# EAGLE design node (EAGLE 7.4.0)
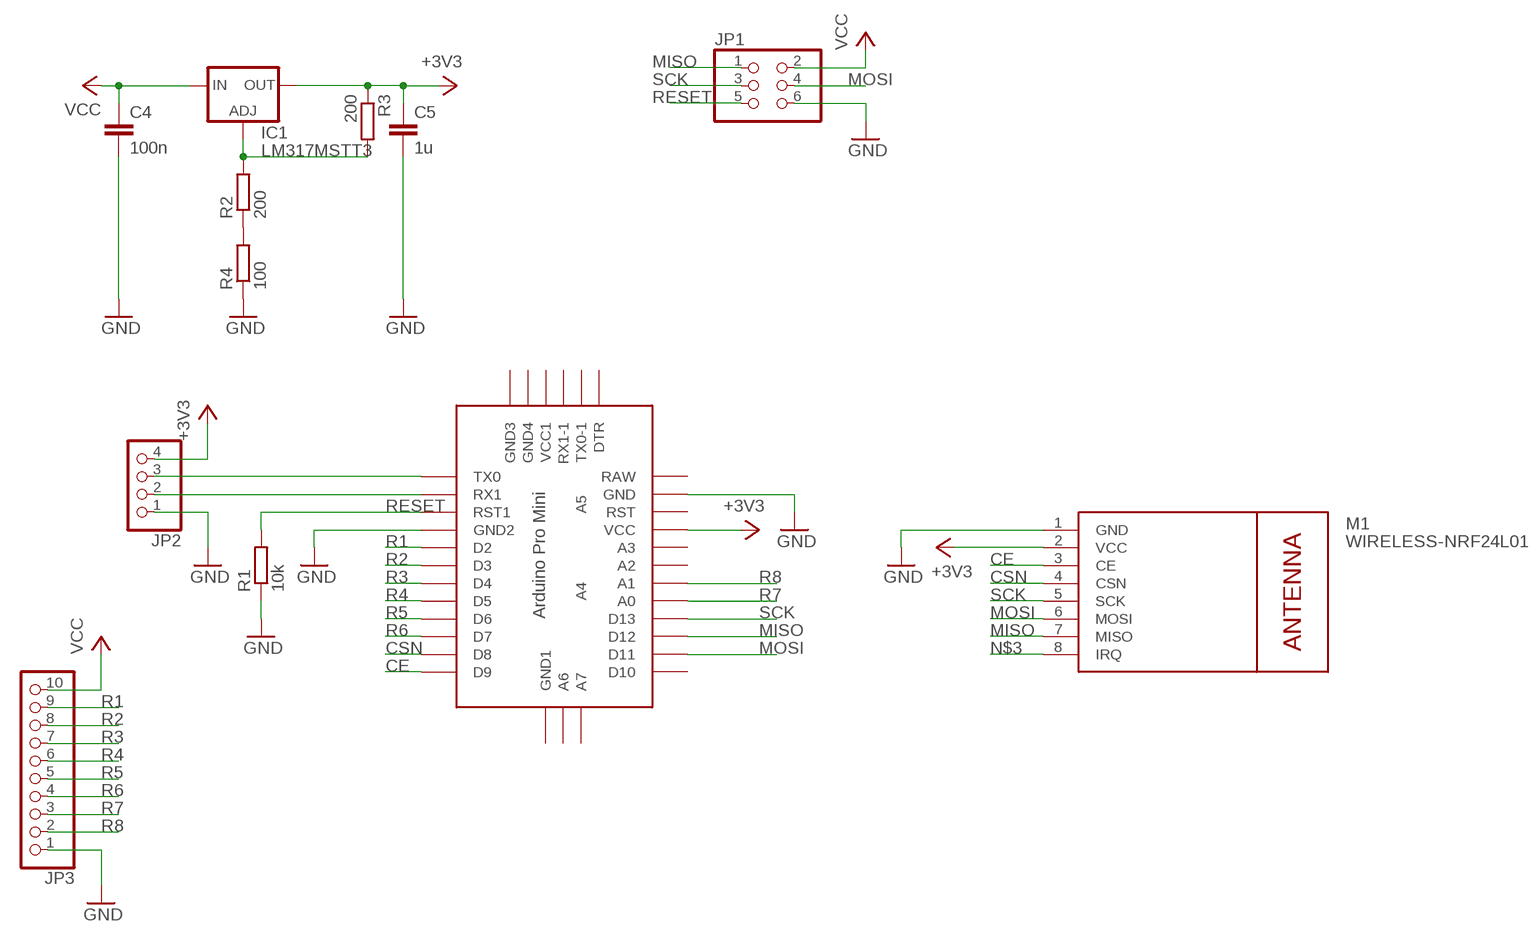
[diagram p0: schematic, sheet 1]

## Parts
C4  100n  C-EUC1206  [C1206]
C5  1u  C-EUC1206  [C1206]
IC1  LM317MSTT3  [SOT223]
JP1  PINHD-2X3  [2X03]
JP2  PINHD-1X4  [1X04]
JP3  PINHD-1X10  [1X10]
M1  WIRELESS-NRF24L01  [WIRELESS-NRF24L01]
R1  10k  R-EU_M1206  [M1206]
R2  200  R-EU_M1206  [M1206]
R3  200  R-EU_M1206  [M1206]
R4  100  R-EU_M1206  [M1206]
U$1  ABK-PRO-MINI  [ABK-PRO-MINI]

## Nets
+3V3: C5.1 IC1.4(OUT) JP2.4 M1.2(VCC) R3.1 U$1.VCC
ADJ_V3: IC1.1(ADJ) R2.2 R3.2
CE: M1.3(CE) U$1.D9
CSN: M1.4(CSN) U$1.D8
GND: C4.2 C5.2 JP1.6 JP2.1 JP3.1 M1.1(GND) R1.1 R4.1 U$1.GND U$1.GND1(GND2)
MISO: JP1.1 M1.7(MISO) U$1.D12
MOSI: JP1.4 M1.6(MOSI) U$1.D11
N$1: JP2.3 U$1.TX0
N$2: JP2.2 U$1.RX1
N$3: M1.8(IRQ)
N$5: R2.1 R4.2
R1: JP3.9 U$1.D2
R2: JP3.8 U$1.D3
R3: JP3.7 U$1.D4
R4: JP3.6 U$1.D5
R5: JP3.5 U$1.D6
R6: JP3.4 U$1.D7
R7: JP3.3 U$1.A0
R8: JP3.2 U$1.A1
RESET: JP1.5 R1.2 U$1.RST1
SCK: JP1.3 M1.5(SCK) U$1.D13
VCC: C4.1 IC1.3(IN) JP1.2 JP3.10
Unconnected: U$1.A2 U$1.A3 U$1.A4 U$1.A5 U$1.A6 U$1.A7 U$1.D10 U$1.DTR U$1.GND2(GND3) U$1.GND3(GND4) U$1.GND4(GND1) U$1.RAW U$1.RST U$1.RX1-1 U$1.TX0-1 U$1.VCC1

## Library data of the parts
C4 C5 = rcl:C-EU: CAPACITOR, European symbol
IC1 = v-reg:LM317?*: 500 mA Adjustable Output Positive Voltage Regulator Source: http://www.onsemi.co.jp .. LM317M-D.PDF
JP1 = pinhead:PINHD-2X3: PIN HEADER
JP2 = pinhead:PINHD-1X4: PIN HEADER
JP3 = pinhead:PINHD-1X10: PIN HEADER
M1 = diy-modules:WIRELESS-NRF24L01: 2.4 GHz Wireless Module based on NRF24L01 chip
R1-R4 = rcl:R-EU_: RESISTOR, European symbol
U$1 = Arduino-clone:ABK-PRO-MINI: ABK Pro-Mini Arduino Clone

## Net classes
0 default: clearance 0.205 mm

## Board
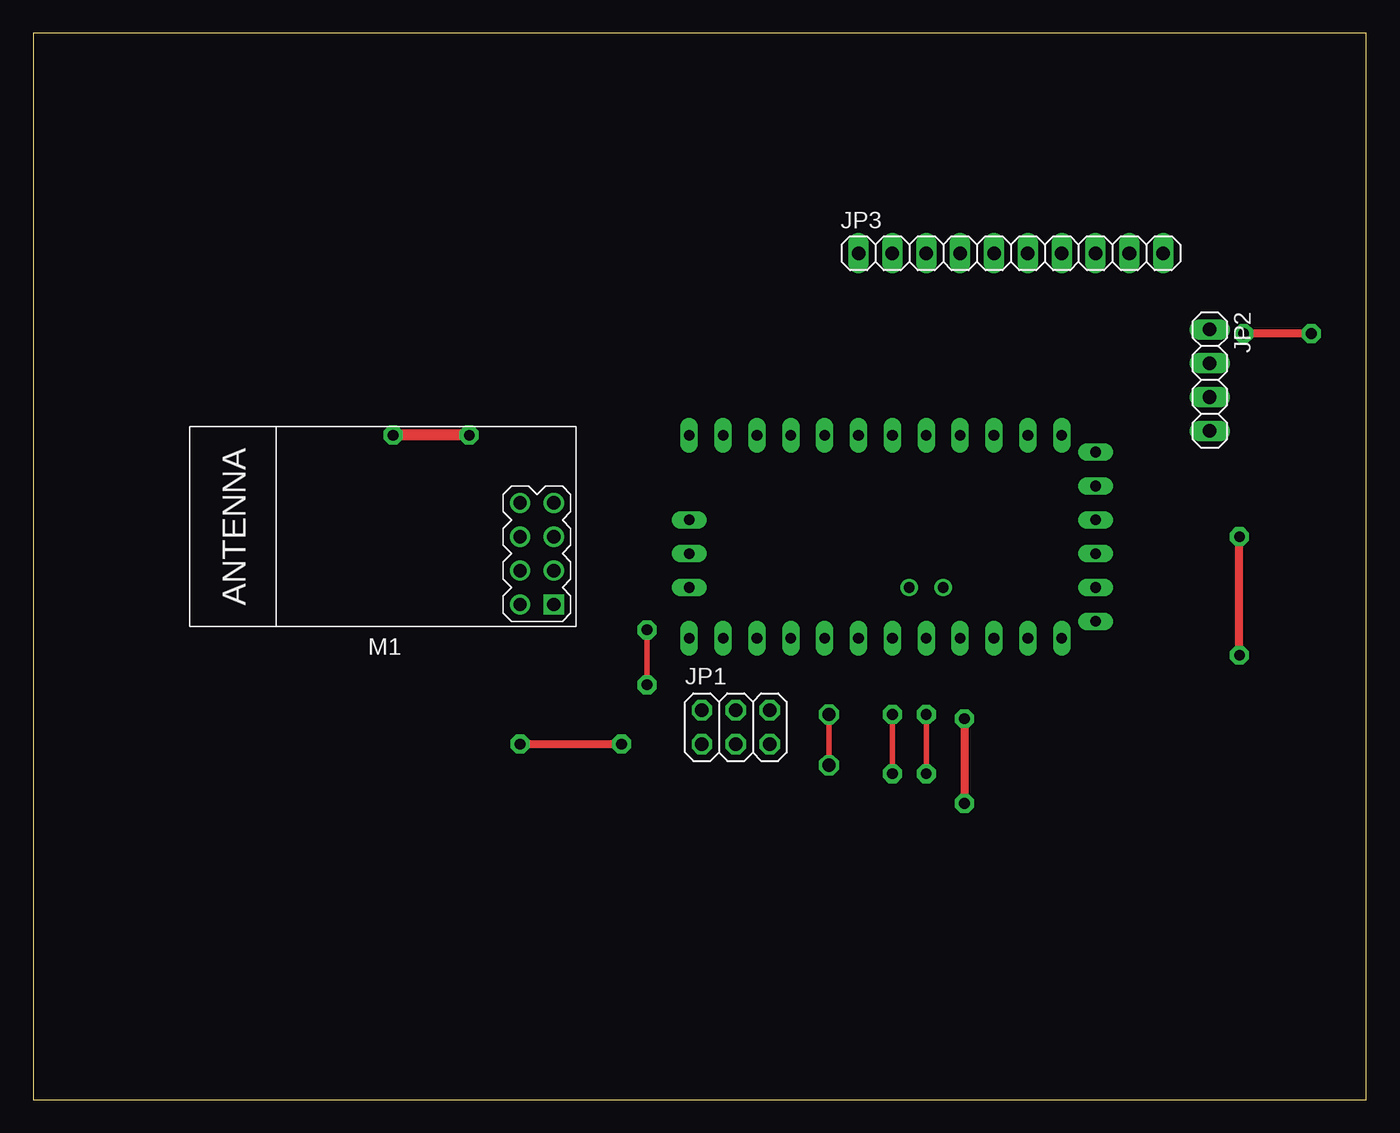
[diagram p1: board, top side]
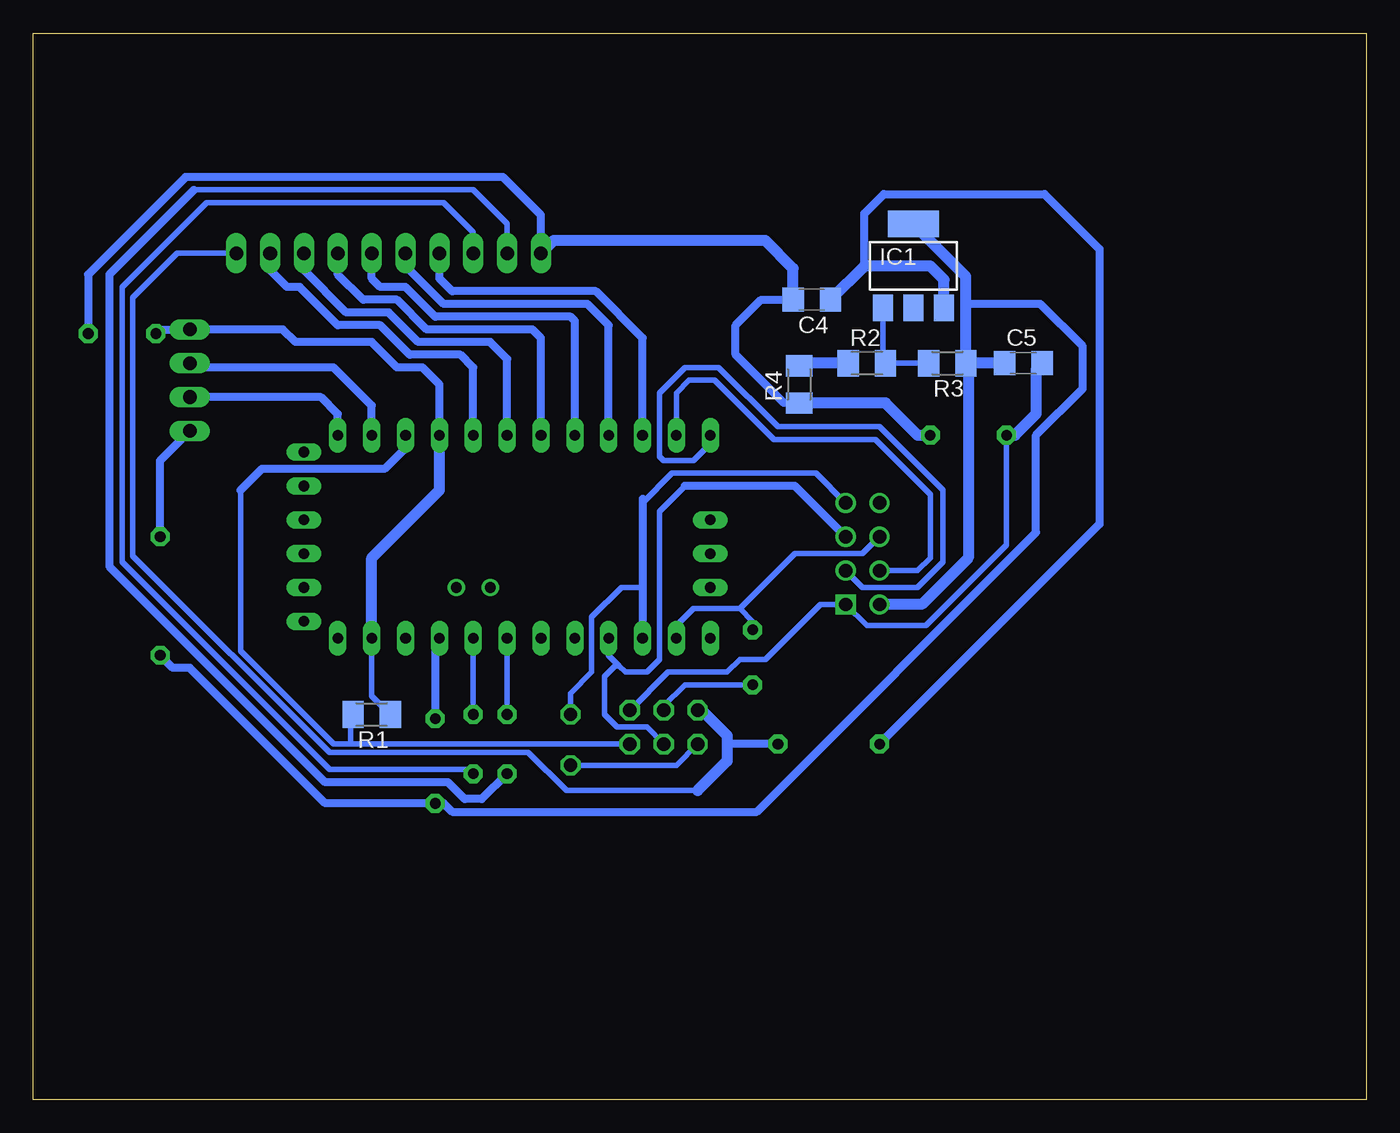
[diagram p2: board, bottom side, seen from below]

Size 100 x 80 mm. Coordinates in mm from the lower left corner, seen from the top.
Outline: 0,0 100,0 100,80 0,80 0,0
Copper layers (1*16): Top 0.035mm / dielectric 1.5mm / Bottom 0.035mm
Design rules "default": minimum track width 10mil, minimum drill 24mil, track to track 8mil, track to pad 8mil, pad to pad 8mil, via to via 8mil, smd to smd 8mil, copper to edge 40mil, drill to drill 8mil, minimum pad ring 10mil, minimum via ring 8mil, stop-mask expansion 4mil, vias tented up to drill 0mil, thermal gap 10mil

### Footprints (pad centres in the part's own frame; a part is rotated, then mirrored left to right if it is on the bottom)
C1206 = smd 1.6 x 1.8: 1 -1.4,0; 2 1.4,0
SOT223 = smd 1.5 x 2: 1 -2.3,-3.15; 2 0,-3.15; 3 2.3,-3.15 | smd 3.8 x 2: 4 0,3.15
2X03 = drill 1.016 octagon: 1 -2.54,-1.27; 2 -2.54,1.27; 3 0,-1.27; 4 0,1.27; 5 2.54,-1.27; 6 2.54,1.27
1X04 = drill 1.016 long: 1 -3.81,0; 2 -1.27,0; 3 1.27,0; 4 3.81,0
1X10 = drill 1.016 long: 1 -11.43,0; 2 -8.89,0; 3 -6.35,0; 4 -3.81,0; 5 -1.27,0; 6 1.27,0; 7 3.81,0; 8 6.35,0; 9 8.89,0; 10 11.43,0
WIRELESS-NRF24L01 = drill 1 square: 1 -12.7,6.35 | drill 1: 2 -10.16,6.35; 3 -12.7,3.81; 4 -10.16,3.81; 5 -12.7,1.27; 6 -10.16,1.27; 7 -12.7,-1.27; 8 -10.16,-1.27
M1206 = smd 1.6 x 2: 1 -1.4,0; 2 1.4,0
ABK-PRO-MINI = drill 0.8 long: A0 10.16,-3.81; A1 10.16,-6.35; A2 10.16,-8.89; A3 10.16,-11.43; A6 3.81,-21.59; A7 6.35,-21.59; D2 -5.08,-3.81; D3 -5.08,-6.35; D4 -5.08,-8.89; D5 -5.08,-11.43; D6 -5.08,-13.97; D7 -5.08,-16.51; D8 -5.08,-19.05; D9 -5.08,-21.59; D10 10.16,-21.59; D11 10.16,-19.05; D12 10.16,-16.51; D13 10.16,-13.97; DTR 8.89,8.89; GND 10.16,3.81; GND1 -5.08,-1.27; GND2 -3.81,8.89; GND3 -1.27,8.89; GND4 1.27,-21.59; RAW 10.16,6.35; RST 10.16,1.27; RST1 -5.08,1.27; RX1 -5.08,3.81; RX1-1 3.81,8.89; TX0 -5.08,6.35; TX0-1 6.35,8.89; VCC 10.16,-1.27; VCC1 1.27,8.89 | drill 0.8: A4 6.35,-5.08; A5 6.35,-2.54

### Placement (x,y rotation side)
C4  41.59,60.01 180 bottom
C5  25.72,55.24 0 bottom
IC1  33.97,62.55 0 bottom
JP1  52.7,27.94 0 top
JP2  88.27,53.98 270 top
JP3  73.34,63.5 0 top
M1  26.35,43.5 180 top
R1  74.61,28.89 180 bottom
R2  37.47,55.24 0 bottom
R3  31.43,55.24 180 bottom
R4  42.55,53.66 90 bottom
U$1  70.8,44.77 270 top

### Tracks (layer width: path | path; a pad name or v marks a point on that pad's centre or on a via)
+3V3  (via drill 0.8 pad 1.42)
  Top 0.61: v69.85,28.57 v69.85,22.23 | v90.49,33.34 v90.49,42.23
  Bottom 0.61: U$1.VCC 69.85,34.29 v69.85,28.57 | v90.49,33.34 89.53,32.38 88.27,32.38 78.11,22.23 v69.85,22.23 69.22,22.23 68.58,21.59 45.72,21.59 24.77,42.55 24.77,49.85 21.27,53.34 21.27,56.52 24.45,59.69 30.03,59.69 | v90.49,42.23 90.49,47.94 JP2.4
  Bottom 0.813: C5.1 R3.1 | R3.1 30.03,59.69 30.03,61.76 IC1.4 | R3.1 29.84,55.06 29.84,40.64 33.34,37.15 M1.2
ADJ_V3
  Bottom 0.406: R3.2 R2.2 36.27,55.24 IC1.1
CE
  Bottom 0.406: 38.73,39.69 M1.3 37.78,38.42 33.66,38.42 31.75,40.32 31.75,45.72 36.51,50.48 44.13,50.48 48.58,54.93 51.12,54.93 53.02,53.02 53.02,48.26 52.7,47.94 50.48,47.94 49.53,48.9 49.53,49.53 U$1.D9
CSN
  Bottom 0.406: U$1.D8 51.75,53.02 50.8,53.98 48.9,53.98 45.72,50.8 45.4,50.48 44.45,49.53 36.83,49.53 32.7,45.4 32.7,40.64 33.66,39.69 M1.4
GND  (via drill 0.8 pad 1.42)
  Top 0.61: v95.89,57.47 v90.81,57.47
  Top 0.813: v32.7,49.85 v26.99,49.85
  Bottom 0.406: R1.1 74.61,30.29 U$1.GND | v26.99,49.85 26.99,41.59 33.02,35.56 37.47,35.56 M1.1 40.96,37.15 45.09,33.02 46.99,33.02 47.94,32.07 52.39,32.07 JP1.6
  Bottom 0.61: U$1.GND1 69.53,53.66 70.8,54.93 72.71,54.93 74.61,56.83 80.33,56.83 81.28,57.78 JP2.1 90.49,57.78 v90.81,57.47 | JP3.1 61.91,66.36 64.77,69.22 88.58,69.22 95.89,61.91 v95.89,57.47 | R4.1 43.69,52.26 47.31,55.88 47.31,58.1 45.4,60.01 C4.2
  Bottom 0.813: C4.2 42.99,62.36 45.09,64.45 60.96,64.45 JP3.1 | U$1.GND 74.61,40.64 69.53,45.72 U$1.GND1 | C5.2 24.77,54.8 24.77,51.44 26.35,49.85 v26.99,49.85 | R4.1 36.06,52.26 33.66,49.85 v32.7,49.85
MISO  (via drill 1)
  Top 0.406: v59.69,28.89 v59.69,25.08
  Bottom 0.406: JP1.1 51.75,25.08 v59.69,25.08 | 54.29,38.42 55.88,38.42 58.1,36.2 58.1,32.07 59.69,30.48 v59.69,28.89 | M1.7 41.27,46.99 52.07,46.99 54.29,44.77
  Bottom 0.61: 54.29,45.09 54.29,44.77 54.29,38.42 U$1.D12
MOSI  (via drill 0.8 pad 1.42)
  Top 0.406: v46.04,31.11 v46.04,35.24
  Bottom 0.406: M1.6 37.78,40.96 42.86,40.96 46.99,36.83 | 46.99,36.83 50.48,36.83 51.75,35.56 U$1.D11 | JP1.4 52.7,29.53 51.12,31.11 v46.04,31.11 | v46.04,35.24 46.04,35.88 46.99,36.83
N$1
  Bottom 0.61: U$1.TX0 77.15,51.44 78.42,52.7 JP2.3
N$2
  Bottom 0.61: U$1.RX1 74.61,52.07 77.47,54.93 87.95,54.93 JP2.2
N$5
  Bottom 0.813: R2.1 42.36,55.24 R4.2
R1
  Bottom 0.61: U$1.D2 66.99,54.93 67.94,55.88 71.75,55.88 73.98,58.1 77.15,58.1 80.01,60.96 80.96,60.96 82.23,62.23 JP3.9
R2
  Bottom 0.61: U$1.D3 64.45,55.56 65.72,56.83 71.12,56.83 73.34,59.05 76.52,59.05 79.69,62.23 JP3.8
R3
  Bottom 0.61: U$1.D4 61.91,57.15 62.55,57.78 70.48,57.78 72.71,60.01 75.25,60.01 77.15,61.91 JP3.7
R4
  Bottom 0.61: U$1.D5 59.37,58.42 59.69,58.74 69.85,58.74 72.07,60.96 73.98,60.96 74.61,61.59 JP3.6
R5
  Bottom 0.61: U$1.D6 56.83,58.1 58.42,59.69 69.22,59.69 72.07,62.55 JP3.5
R6
  Bottom 0.61: U$1.D7 54.29,57.15 57.78,60.64 68.58,60.64 69.53,61.59 JP3.4
R7  (via drill 0.8 pad 1.42)
  Top 0.406: v66.99,28.89 v66.99,24.45
  Bottom 0.406: U$1.A0 v66.99,28.89 | v66.99,24.45 67.31,24.77 77.79,24.77 93.34,40.32 93.34,60.96 87,67.31 69.22,67.31 66.99,65.09 JP3.3
R8  (via drill 0.8 pad 1.42)
  Top 0.406: v64.45,24.45 v64.45,28.89
  Bottom 0.406: JP3.2 64.45,65.72 66.99,68.26 87.95,68.26 | v64.45,28.89 U$1.A1
  Bottom 0.61: 87.95,68.26 94.3,61.91 94.3,40.01 78.11,23.81 68.9,23.81 67.63,22.54 66.36,22.54 v64.45,24.45
RESET
  Bottom 0.406: JP1.5 76.2,26.67 | 76.2,26.67 77.47,26.67 84.45,33.66 84.45,45.72 | R1.2 76.2,28.7 76.2,26.67
  Bottom 0.61: U$1.RST1 72.07,48.9 73.66,47.31 82.87,47.31 84.45,45.72
SCK
  Bottom 0.406: 51.12,46.04 53.02,44.13 53.02,33.02 53.98,32.07 55.56,32.07 56.04,32.54 | 56.04,32.54 56.83,33.34 U$1.D13 | JP1.3 53.98,27.94 56.2,27.94 57.15,28.89 57.15,31.75 56.36,32.54 56.04,32.54
  Bottom 0.61: M1.5 42.86,46.04 51.12,46.04
VCC  (via drill 0.8 pad 1.42)
  Top 0.61: v36.51,26.67 v44.13,26.67
  Bottom 0.406: 50.16,23.18 60.01,23.18 62.87,26.04 77.79,26.04 92.55,40.8 92.55,60.17 89.22,63.5 JP3.10
  Bottom 0.61: 37.65,62.55 37.65,66.49 36.2,67.94 24.13,67.94 20,63.82 20,43.18 v36.51,26.67 | v44.13,26.67 47.62,26.67 47.94,26.99
  Bottom 0.813: IC1.3 31.67,61.52 32.7,62.55 37.65,62.55 C4.1 | JP1.2 49.85,29.21 47.94,27.3 47.94,26.99 47.94,25.4 50.16,23.18